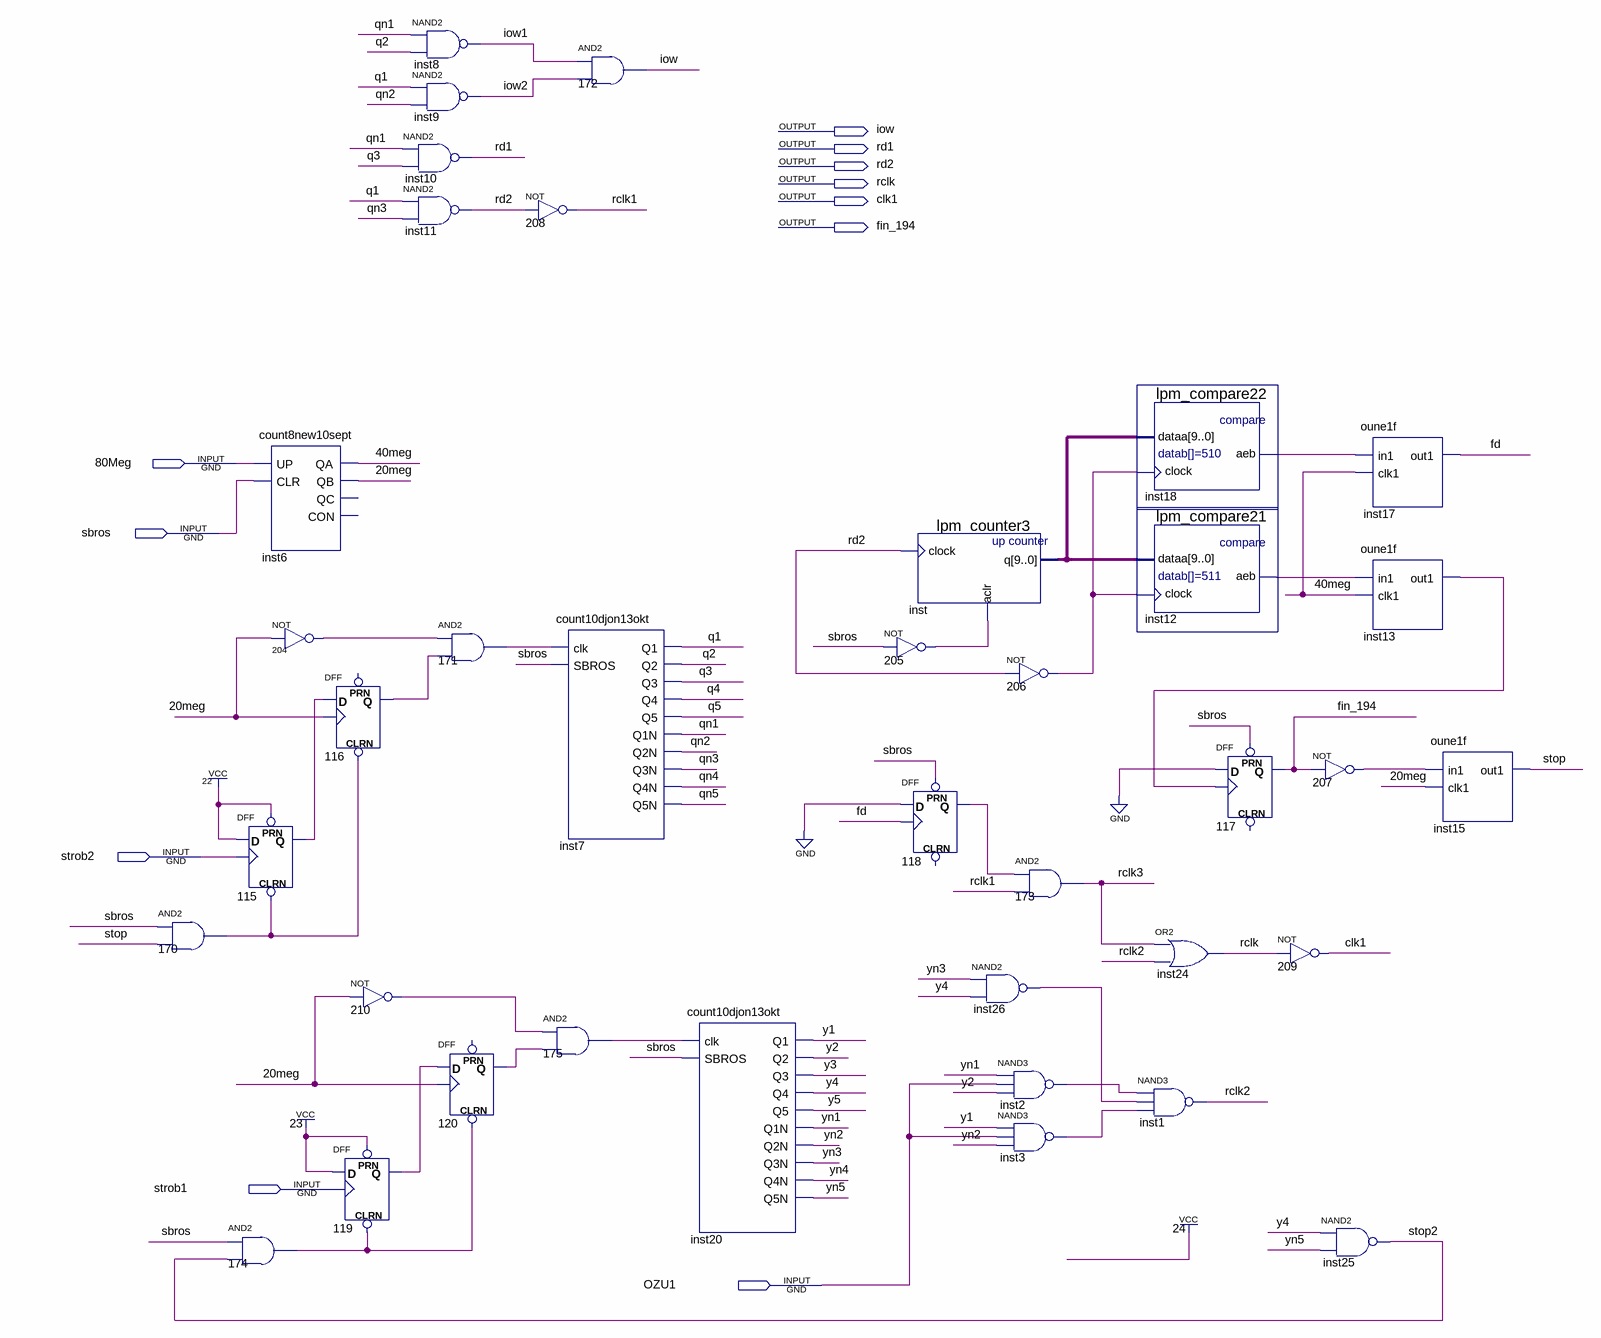
[diagram p0: schematic sheet]
// Quartus schematic 192new2018.bdf as structural Verilog: 38 symbols, 11 pins
module \192new2018  (
  input  \80Meg ,
  input  sbros,
  input  strob2,
  input  strob1,
  input  OZU1,
  output iow,
  output rd1,
  output rd2,
  output rclk,
  output clk1,
  output fin_194
);

  wire \20meg , \40meg , fd, inst2_out, inst3_out, inst12_aeb, inst13_out1, inst18_aeb, inst26_out, iow1,
       iow2, n115_q, n116_q, n118_q, n119_q, n120_q, n170_out, n171_out, n174_out, n175_out, n204_out,
       n205_out, n206_out, n207_out, n210_out, q1, q2, q3, q4, q5, qn1, qn2, qn3, qn4, qn5, rclk1, rclk2,
       rclk3, stop, stop2, y1, y2, y3, y4, y5, yn1, yn2, yn3, yn4, yn5;
  wire [9:0] inst_q;

  and u_170 (n170_out, sbros, stop);
  count8new10sept inst6 (.UP(\80Meg ), .CLR(sbros), .QA(\40meg ), .QB(\20meg ));  // open: QC, CON
  not u_204 (n204_out, \20meg );
  DFF u_115 (.CLRN(n170_out), .CLK(strob2), .D(1'b1), .PRN(1'b1), .Q(n115_q));
  and u_174 (n174_out, sbros, stop2);
  DFF u_116 (.CLRN(n170_out), .CLK(\20meg ), .D(n115_q), .Q(n116_q));  // open: PRN
  not u_210 (n210_out, \20meg );
  DFF u_119 (.CLRN(n174_out), .CLK(strob1), .D(1'b1), .PRN(1'b1), .Q(n119_q));
  nand inst8 (iow1, qn1, q2);
  nand inst9 (iow2, q1, qn2);
  nand inst10 (rd1, qn1, q3);
  nand inst11 (rd2, q1, qn3);
  and u_171 (n171_out, n204_out, n116_q);
  DFF u_120 (.CLRN(n174_out), .CLK(\20meg ), .D(n119_q), .Q(n120_q));  // open: PRN
  not u_208 (rclk1, rd2);
  count10djon13okt inst7 (
    .clk(n171_out), .SBROS(sbros), .Q1(q1), .Q2(q2), .Q3(q3), .Q4(q4), .Q5(q5), .Q1N(qn1), .Q2N(qn2),
    .Q3N(qn3), .Q4N(qn4), .Q5N(qn5));
  and u_175 (n175_out, n210_out, n120_q);
  and u_172 (iow, iow1, iow2);
  count10djon13okt inst20 (
    .clk(n175_out), .SBROS(sbros), .Q1(y1), .Q2(y2), .Q3(y3), .Q4(y4), .Q5(y5), .Q1N(yn1), .Q2N(yn2),
    .Q3N(yn3), .Q4N(yn4), .Q5N(yn5));
  lpm_counter3 inst (.clock(rd2), .aclr(n205_out), .q(inst_q));
  not u_205 (n205_out, sbros);
  DFF u_118 (.CLK(fd), .D(1'b0), .PRN(sbros), .Q(n118_q));  // open: CLRN
  nand inst26 (inst26_out, yn3, y4);
  not u_206 (n206_out, rd2);
  and u_173 (rclk3, n118_q, rclk1);
  nand inst2 (inst2_out, yn1, OZU1, y2);
  nand inst3 (inst3_out, y1, OZU1, yn2);
  lpm_compare22 inst18 (.dataa(inst_q), .clock(n206_out), .aeb(inst18_aeb));
  lpm_compare21 inst12 (.dataa(inst_q), .clock(n206_out), .aeb(inst12_aeb));
  or inst24 (rclk, rclk3, rclk2);
  nand inst1 (rclk2, inst2_out, inst26_out, inst3_out);
  DFF u_117 (.CLK(inst13_out1), .D(1'b0), .PRN(sbros), .Q(fin_194));  // open: CLRN
  not u_207 (n207_out, fin_194);
  not u_209 (clk1, rclk);
  nand inst25 (stop2, y4, yn5);
  oune1f inst17 (.in1(inst18_aeb), .clk1(\40meg ), .out1(fd));
  oune1f inst13 (.in1(inst12_aeb), .clk1(\40meg ), .out1(inst13_out1));
  oune1f inst15 (.in1(n207_out), .clk1(\20meg ), .out1(stop));
endmodule
